# EAGLE design pboard (EAGLE 5.06)
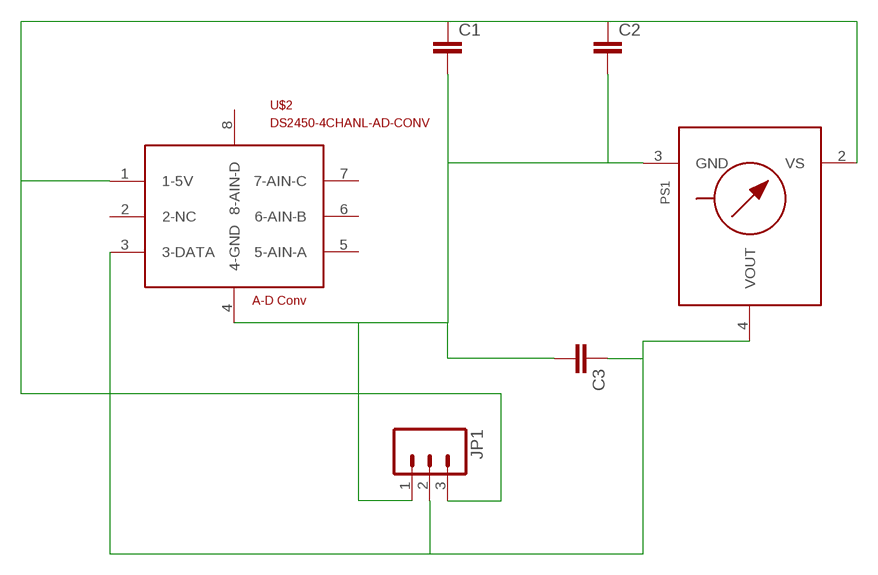
[diagram p0: schematic, sheet 1]

## Parts
C1  CAP0805  [0805]
C2  CAP0805  [0805]
C3  CAP0805  [0805]
JP1  M03LOCK_LONGPADS  [1X03_LOCK_LONGPADS]
PS1  MPX-482C  [482C]
U$2  DS2450-4CHANL-AD-CONV  [SOIC-8-WIDE-300MIL]

## Nets
5V: C1.1 C2.1 JP1.3 PS1.2(VS) U$2.1(1-5V)
DATA: C3.1 JP1.2 PS1.4(VOUT) U$2.3(3-DATA)
GROUND: C1.2 C2.2 C3.2 JP1.1 PS1.3(GND) U$2.4(4-GND)
Unconnected: PS1.1(NC) PS1.5(NC) PS1.6(NC) U$2.2(2-NC) U$2.5(5-AIN-A) U$2.6(6-AIN-B) U$2.7(7-AIN-C) U$2.8(8-AIN-D)

## Library data of the parts
C1-C3 = SparkFun:CAP: Capacitor Standard 0603 ceramic capacitor, and 0.1" leaded capacitor.
JP1 = SparkFun:M03: Header 3 Standard 3-pin 0.1" header. Use with straight break away headers (SKU : PRT-00116), right angle break away headers (PRT-00553), swiss pins (PRT-00743), machine pins (PRT-00117), and female headers (PRT-00115). Molex polarized connector foot print use with SKU : PRT-08232 with associated crimp pins and housings.
PS1 = mpx-freescale:MPX*****: Generic MPX pressure sensor
U$2 = CindysStuff:DS2450-4CHANL-AD-CONV

## Board
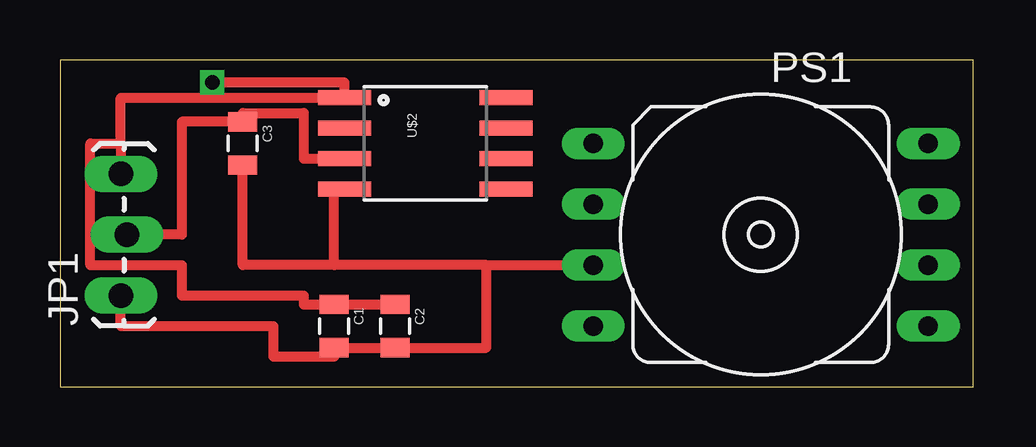
[diagram p1: board, top side]
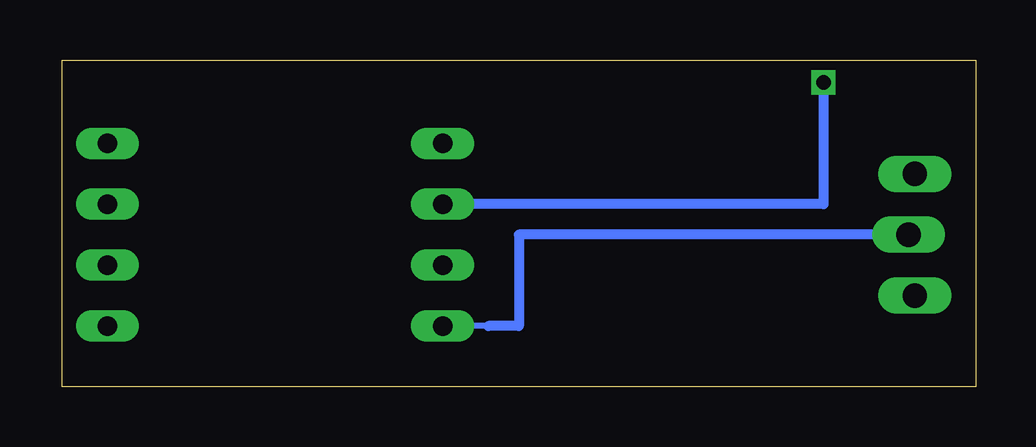
[diagram p2: board, bottom side, seen from below]

Size 38.08 x 13.64 mm. Coordinates in mm from the lower left corner, seen from the top.
Outline: 0,0 38.08,0 38.08,13.64 0,13.64 0,0
Copper layers (1*16): Top 0.035mm / dielectric 1.5mm / Bottom 0.035mm
Design rules "default": minimum track width 10mil, minimum drill 24mil, track to track 8mil, track to pad 8mil, pad to pad 8mil, via to via 8mil, smd to smd 8mil, copper to edge 40mil, drill to drill 8mil, minimum pad ring 10mil, minimum via ring 8mil, stop-mask expansion 4mil, vias tented up to drill 0mil, thermal gap 10mil

### Footprints (pad centres in the part's own frame; a part is rotated, then mirrored left to right if it is on the bottom)
0805 = smd 0.8 x 1.2: 1 -0.9,0; 2 0.9,0
1X03_LOCK_LONGPADS = drill 1.016 long: 1 0,0; 2 2.54,-0.254; 3 5.08,0
482C = drill 0.813 long: 1 6.985,-3.81; 2 6.985,-1.27; 3 6.985,1.27; 4 6.985,3.81; 5 -6.985,3.81; 6 -6.985,1.27; 7 -6.985,-1.27; 8 -6.985,-3.81
SOIC-8-WIDE-300MIL = smd 0.61 x 2.21: 1 -1.905,-3.378; 2 -0.635,-3.378; 3 0.635,-3.378; 4 1.905,-3.378; 5 1.905,3.353; 6 0.635,3.353; 7 -0.635,3.353; 8 -1.905,3.353

### Placement (x,y rotation side)
C1  11.43,2.54 270 top
C2  13.97,2.54 270 top
C3  7.62,10.16 270 top
JP1  2.54,3.81 90 top
PS1  29.21,6.35 180 top
U$2  15.24,10.16 270 top

### Tracks (layer width: path | path; a pad name or v marks a point on that pad's centre or on a via)
5V  (via drill 0.6)
  Top 0.406: C2.1 C1.1 10.16,3.44 10.16,3.81 5.08,3.81 5.08,5.08 1.27,5.08 1.27,10.16 2.54,10.16 | 2.54,10.16 JP1.3 | 2.54,10.16 2.54,12.06 U$2.1 11.86,12.7 v6.35,12.7
  Bottom 0.406: PS1.2 6.35,7.62 v6.35,12.7
DATA
  Top 0.406: U$2.3 10.16,9.52 10.16,11.43 7.62,11.43 C3.1 5.08,11.06 5.08,6.35 JP1.2
  Bottom 0.254: 20.32,2.54 PS1.4
  Bottom 0.406: 20.32,2.54 19.05,2.54 19.05,6.35 JP1.2
GROUND
  Top 0.406: 17.78,5.08 PS1.3 | 17.78,5.08 17.78,1.64 C2.2 C1.2 11.43,1.27 8.89,1.27 8.89,2.54 2.54,2.54 JP1.1 | C3.2 7.62,5.08 11.43,5.08 | 17.78,5.08 11.43,5.08 | U$2.4 11.43,8.25 11.43,5.08